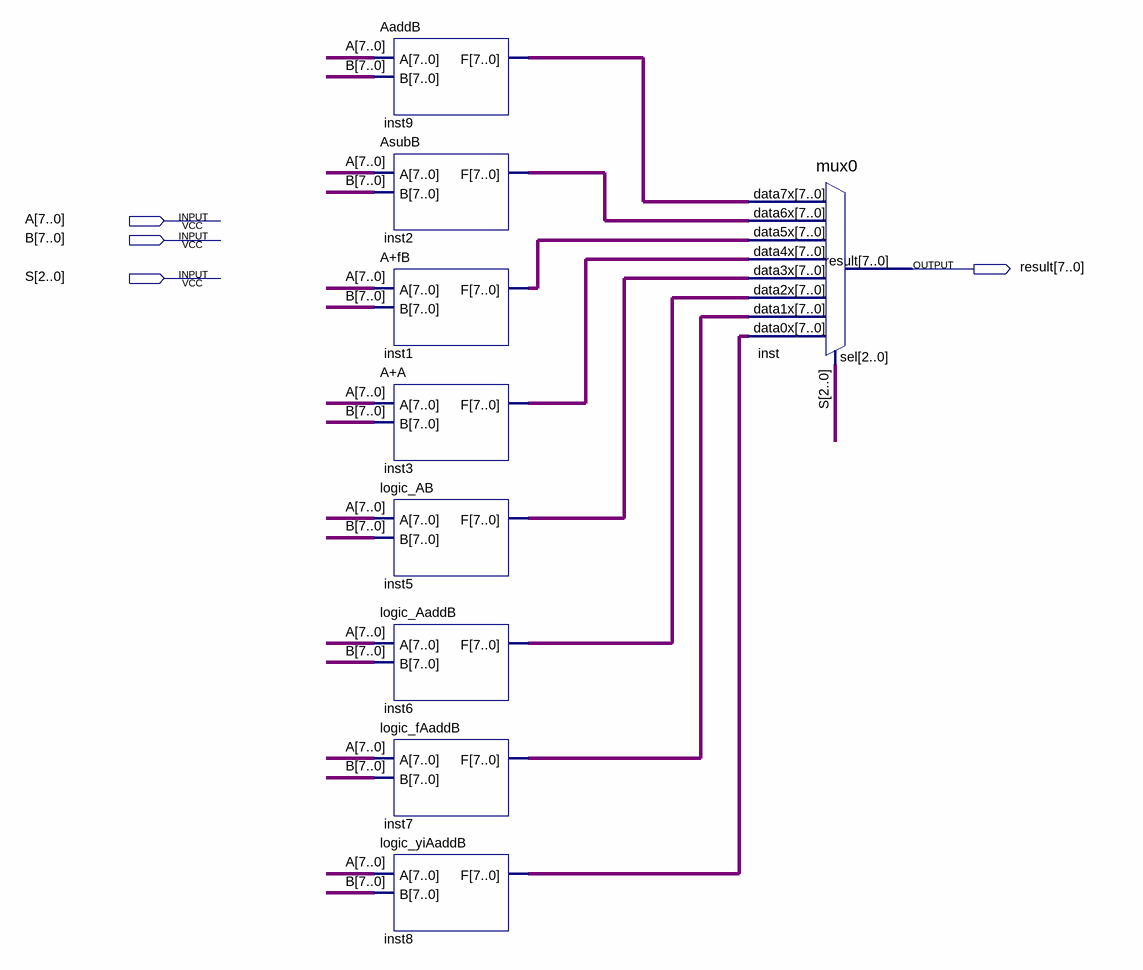
[diagram p0: schematic sheet]
// Quartus schematic 8choose1.bdf as structural Verilog: 9 symbols, 4 pins
module \8choose1  (
  input  [7:0] A,
  input  [7:0] B,
  input  [2:0] S,
  output [7:0] result
);

  wire [7:0] inst1_f, inst2_f, inst3_f, inst5_f, inst6_f, inst7_f, inst8_f, inst9_f;

  AaddB inst9 (.A(A), .B(B), .F(inst9_f));
  AsubB inst2 (.A(A), .B(B), .F(inst2_f));
  \A+fB  inst1 (.A(A), .B(B), .F(inst1_f));
  \A+A  inst3 (.A(A), .B(B), .F(inst3_f));
  logic_AB inst5 (.A(A), .B(B), .F(inst5_f));
  logic_AaddB inst6 (.A(A), .B(B), .F(inst6_f));
  logic_fAaddB inst7 (.A(A), .B(B), .F(inst7_f));
  logic_yiAaddB inst8 (.A(A), .B(B), .F(inst8_f));
  mux0 inst (
    .data7x(inst9_f), .data6x(inst2_f), .data5x(inst1_f), .data4x(inst3_f), .data3x(inst5_f),
    .data2x(inst6_f), .data1x(inst7_f), .data0x(inst8_f), .sel(S), .result(result));
endmodule
